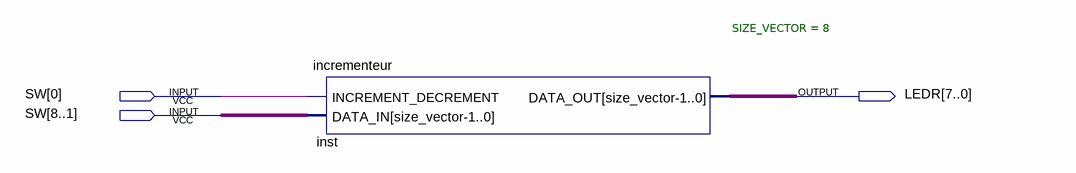
[diagram p0: schematic sheet]
// Quartus schematic incrementeur_test.bdf as structural Verilog: 1 symbols, 3 pins
module incrementeur_test (
  input  [8:0] SW,
  output [7:0] LEDR
);

  incrementeur #(.SIZE_VECTOR(8)) inst (.INCREMENT_DECREMENT(SW[0]), .DATA_IN(SW[8:1]), .DATA_OUT(LEDR));
endmodule
